# EAGLE design vidc_interposer2-PTH (EAGLE 9.4.2)
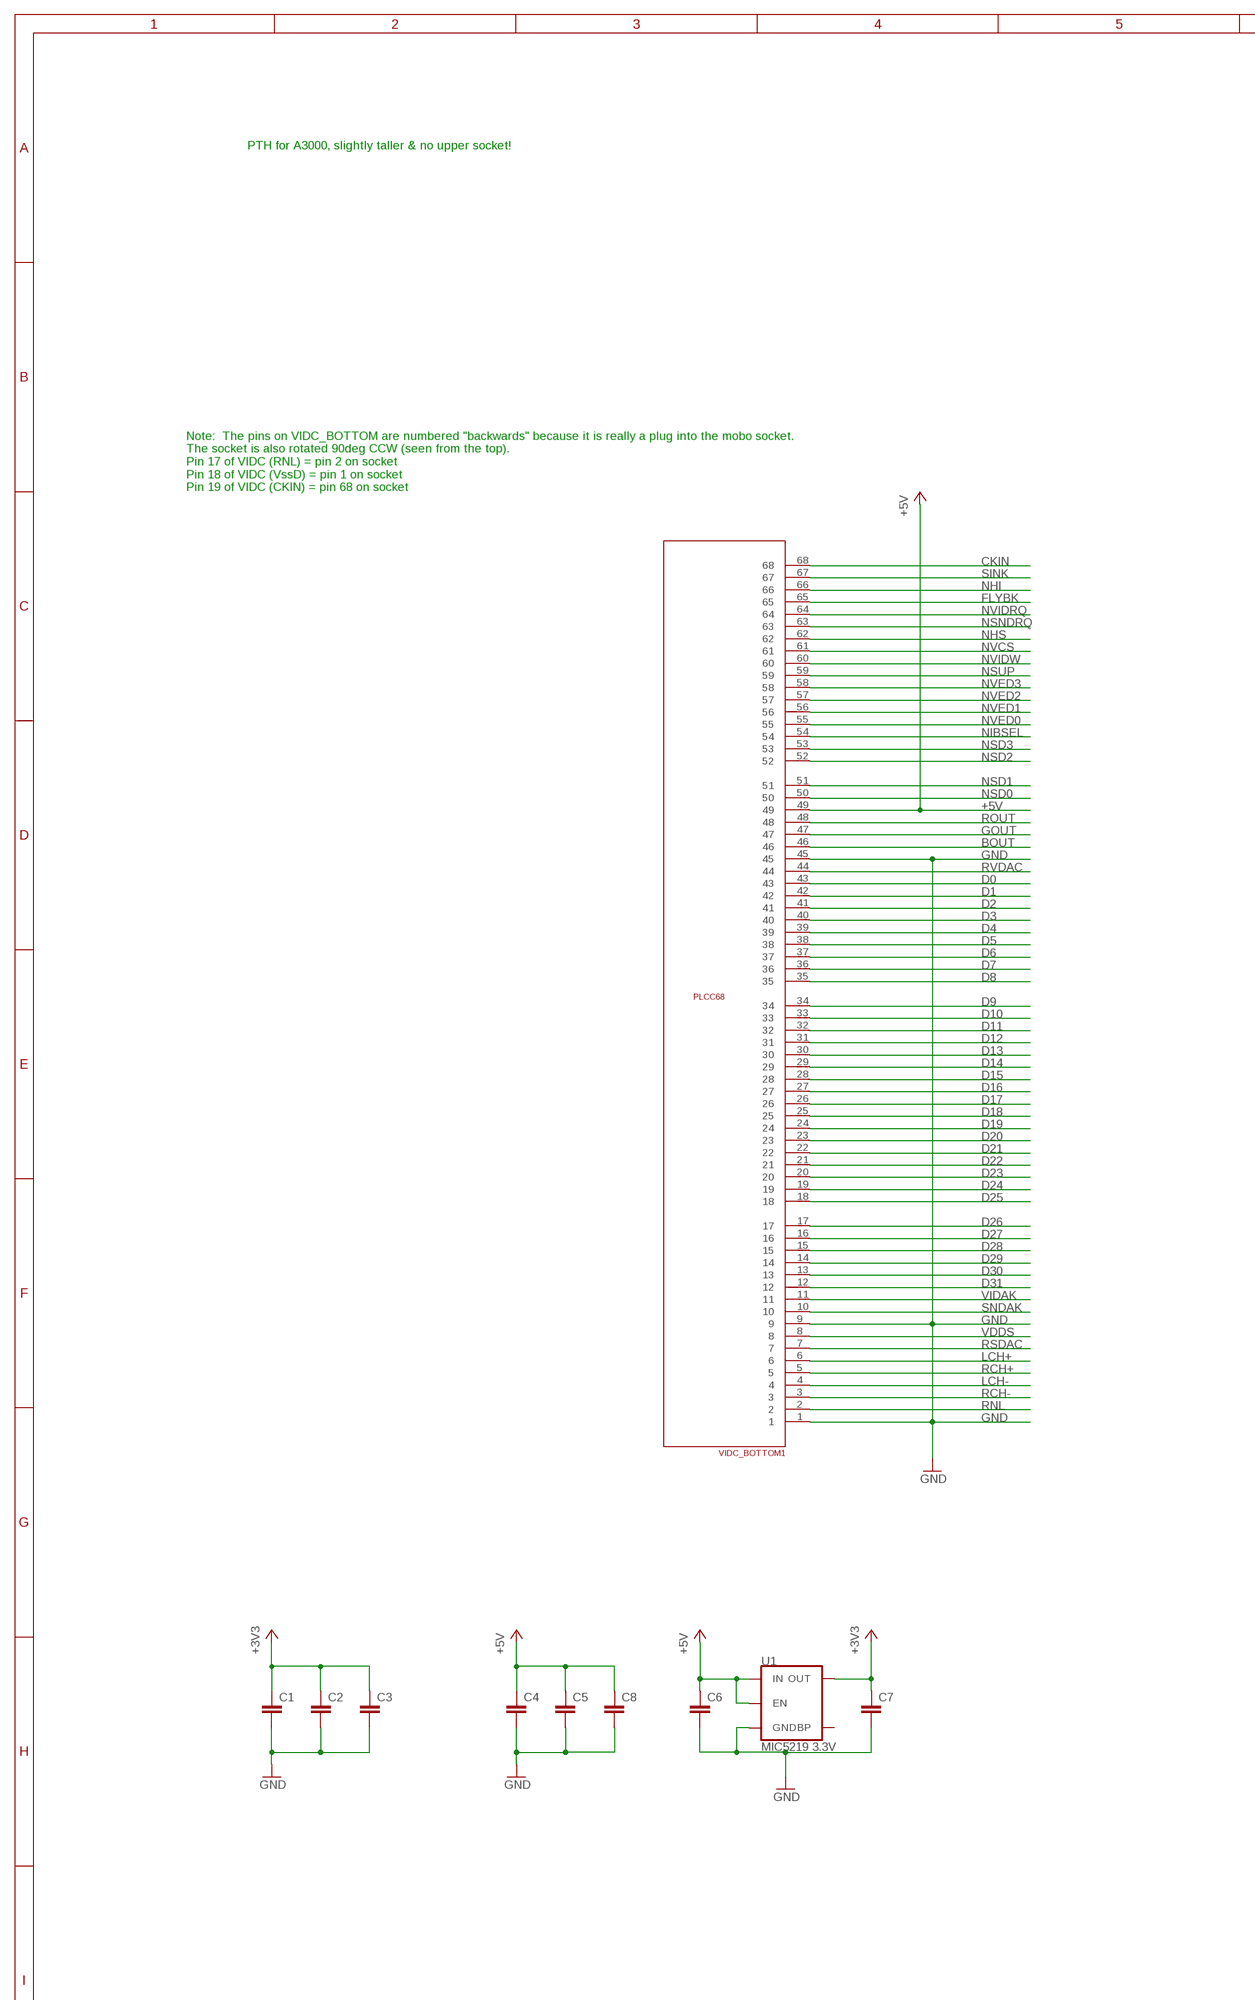
[diagram p0: schematic, sheet 1, part 1 of 2]
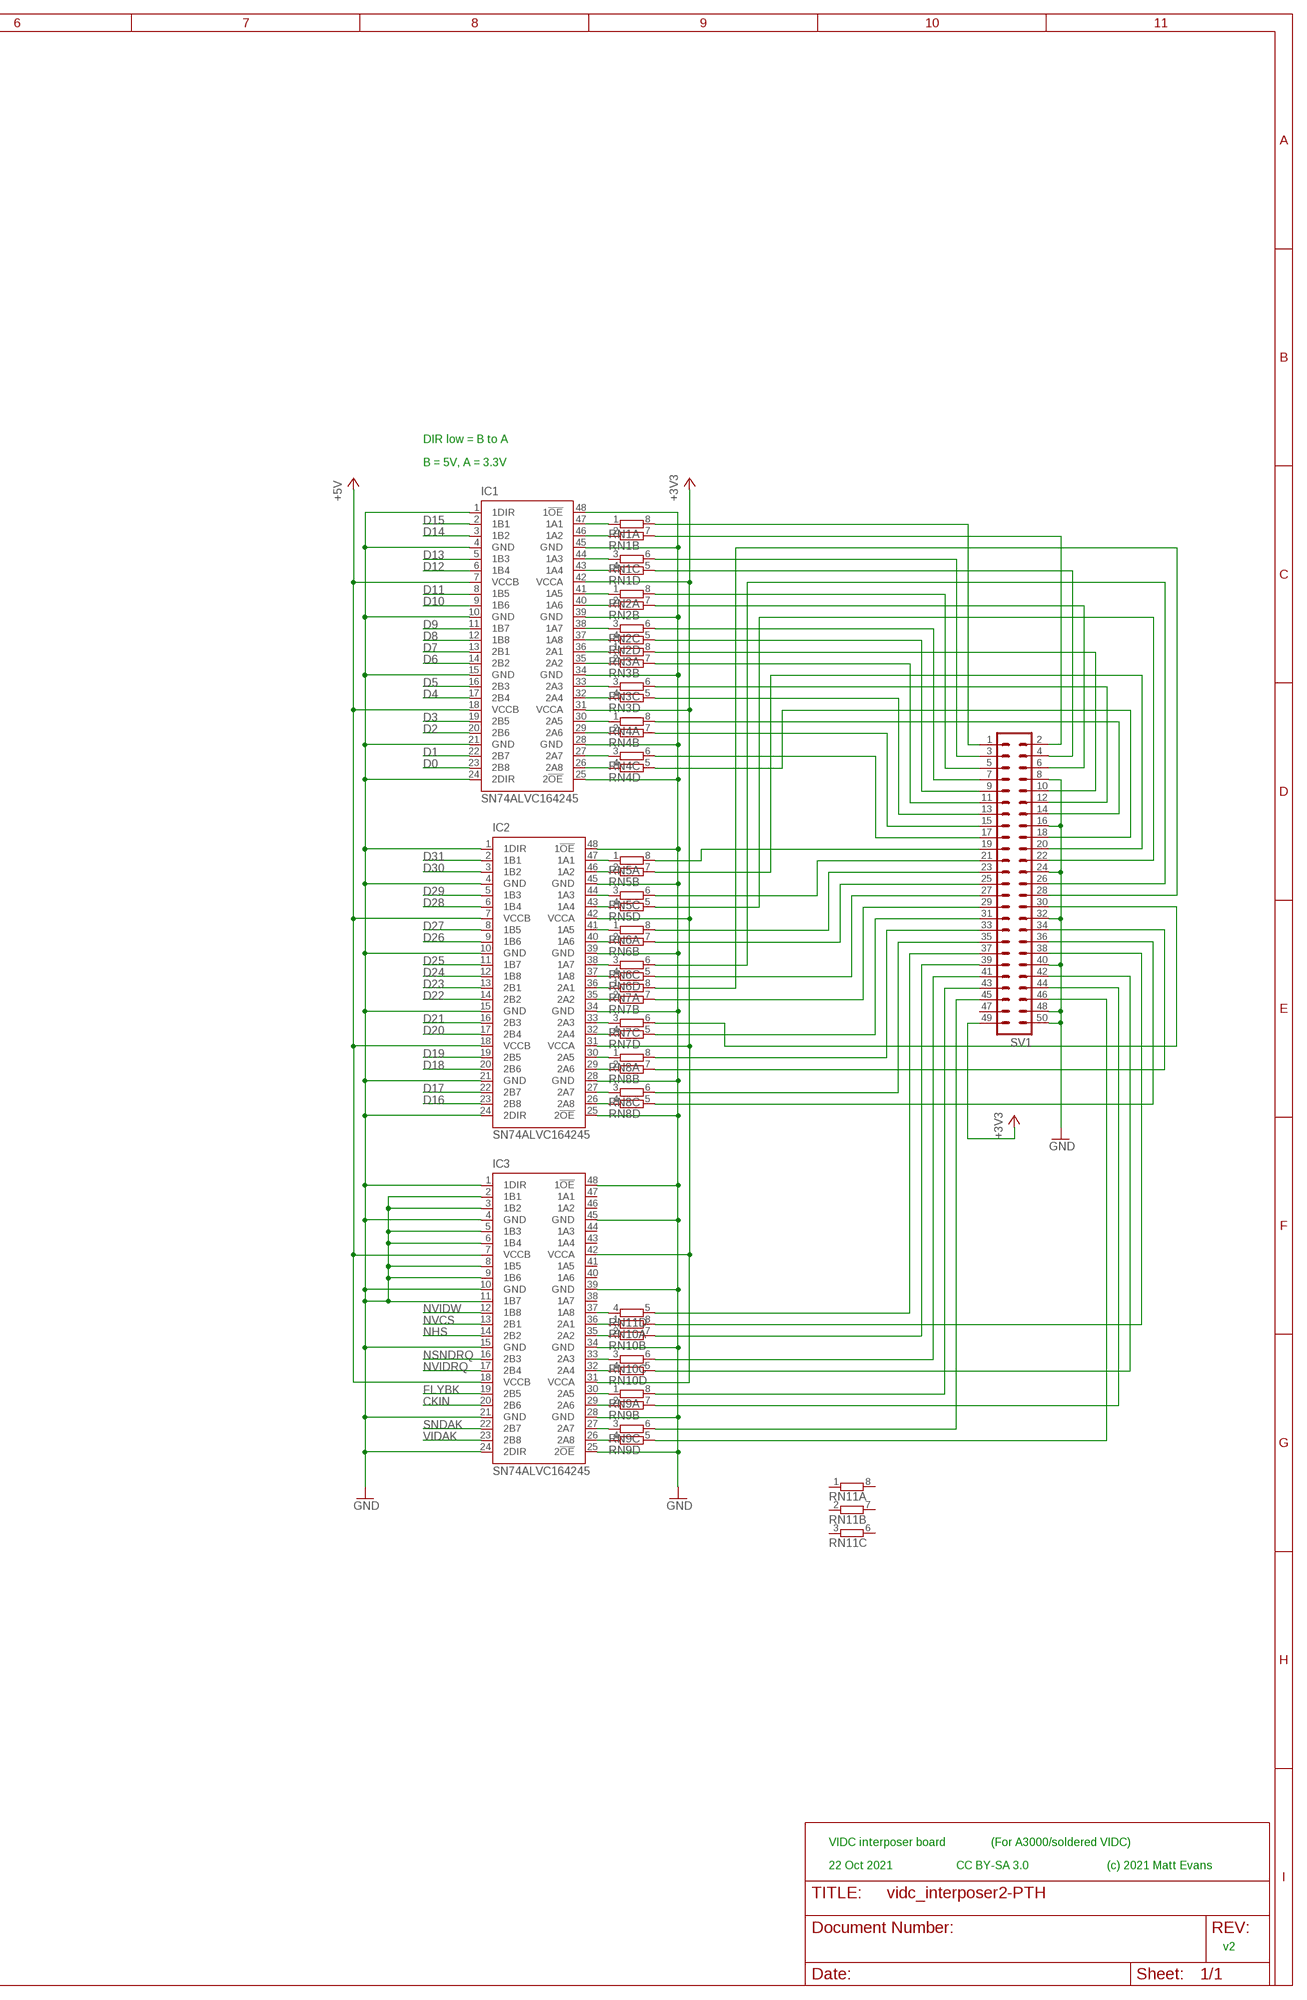
[diagram p1: schematic, sheet 1, part 2 of 2]

## Parts
C1  C-EUC0805  [C0805]
C2  C-EUC0805  [C0805]
C3  C-EUC0805  [C0805]
C4  C-EUC0805  [C0805]
C5  C-EUC0805  [C0805]
C6  C-EUC0805  [C0805]
C7  C-EUC0805  [C0805]
C8  C-EUC0805  [C0805]
IC1  SN74ALVC164245  [DL_R-PDSO-G48]
IC2  SN74ALVC164245  [DL_R-PDSO-G48]
IC3  SN74ALVC164245  [DL_R-PDSO-G48]
RN1  4R-NCAY16  [CAY16]
RN2  4R-NCAY16  [CAY16]
RN3  4R-NCAY16  [CAY16]
RN4  4R-NCAY16  [CAY16]
RN5  4R-NCAY16  [CAY16]
RN6  4R-NCAY16  [CAY16]
RN7  4R-NCAY16  [CAY16]
RN8  4R-NCAY16  [CAY16]
RN9  4R-NCAY16  [CAY16]
RN10  4R-NCAY16  [CAY16]
RN11  4R-NCAY16  [CAY16]
SV1  ML50  [ML50]
U1  MIC5219 3.3V  V_REG_MIC52193.3V  [SOT23-5]
VIDC_BOTTOM1  RAW_PLCC68PTH  [S68]

## Nets
+3V3: C1.1 C2.1 C3.1 C7.1 IC1.31(VCCA) IC1.42(VCCA) IC2.31(VCCA) IC2.42(VCCA) IC3.31(VCCA) IC3.42(VCCA) SV1.49 U1.5(OUT)
+5V: C4.1 C5.1 C6.1 C8.1 IC1.7(VCCB) IC1.18(VCCB) IC2.7(VCCB) IC2.18(VCCB) IC3.7(VCCB) IC3.18(VCCB) U1.1(IN) U1.3(EN) VIDC_BOTTOM1.49
BOUT: VIDC_BOTTOM1.46
CKIN: IC3.20(2B6) VIDC_BOTTOM1.68
D0: IC1.23(2B8) VIDC_BOTTOM1.43
D1: IC1.22(2B7) VIDC_BOTTOM1.42
D2: IC1.20(2B6) VIDC_BOTTOM1.41
D3: IC1.19(2B5) VIDC_BOTTOM1.40
D4: IC1.17(2B4) VIDC_BOTTOM1.39
D5: IC1.16(2B3) VIDC_BOTTOM1.38
D6: IC1.14(2B2) VIDC_BOTTOM1.37
D7: IC1.13(2B1) VIDC_BOTTOM1.36
D8: IC1.12(1B8) VIDC_BOTTOM1.35
D9: IC1.11(1B7) VIDC_BOTTOM1.34
D10: IC1.9(1B6) VIDC_BOTTOM1.33
D11: IC1.8(1B5) VIDC_BOTTOM1.32
D12: IC1.6(1B4) VIDC_BOTTOM1.31
D13: IC1.5(1B3) VIDC_BOTTOM1.30
D14: IC1.3(1B2) VIDC_BOTTOM1.29
D15: IC1.2(1B1) VIDC_BOTTOM1.28
D16: IC2.23(2B8) VIDC_BOTTOM1.27
D17: IC2.22(2B7) VIDC_BOTTOM1.26
D18: IC2.20(2B6) VIDC_BOTTOM1.25
D19: IC2.19(2B5) VIDC_BOTTOM1.24
D20: IC2.17(2B4) VIDC_BOTTOM1.23
D21: IC2.16(2B3) VIDC_BOTTOM1.22
D22: IC2.14(2B2) VIDC_BOTTOM1.21
D23: IC2.13(2B1) VIDC_BOTTOM1.20
D24: IC2.12(1B8) VIDC_BOTTOM1.19
D25: IC2.11(1B7) VIDC_BOTTOM1.18
D26: IC2.9(1B6) VIDC_BOTTOM1.17
D27: IC2.8(1B5) VIDC_BOTTOM1.16
D28: IC2.6(1B4) VIDC_BOTTOM1.15
D29: IC2.5(1B3) VIDC_BOTTOM1.14
D30: IC2.3(1B2) VIDC_BOTTOM1.13
D31: IC2.2(1B1) VIDC_BOTTOM1.12
FLYBK: IC3.19(2B5) VIDC_BOTTOM1.65
GND: C1.2 C2.2 C3.2 C4.2 C5.2 C6.2 C7.2 C8.2 IC1.1(1DIR) IC1.4(GND) IC1.10(GND) IC1.15(GND) IC1.21(GND) IC1.24(2DIR) IC1.25(2!OE) IC1.28(GND) IC1.34(GND) IC1.39(GND) IC1.45(GND) IC1.48(1!OE) IC2.1(1DIR) IC2.4(GND) IC2.10(GND) IC2.15(GND) IC2.21(GND) IC2.24(2DIR) IC2.25(2!OE) IC2.28(GND) IC2.34(GND) IC2.39(GND) IC2.45(GND) IC2.48(1!OE) IC3.1(1DIR) IC3.2(1B1) IC3.3(1B2) IC3.4(GND) IC3.5(1B3) IC3.6(1B4) IC3.8(1B5) IC3.9(1B6) IC3.10(GND) IC3.11(1B7) IC3.15(GND) IC3.21(GND) IC3.24(2DIR) IC3.25(2!OE) IC3.28(GND) IC3.34(GND) IC3.39(GND) IC3.45(GND) IC3.48(1!OE) SV1.8 SV1.16 SV1.24 SV1.32 SV1.40 SV1.48 SV1.50 U1.2(GND) VIDC_BOTTOM1.1 VIDC_BOTTOM1.9 VIDC_BOTTOM1.45
GOUT: VIDC_BOTTOM1.47
LCH+: VIDC_BOTTOM1.6
LCH-: VIDC_BOTTOM1.4
N$1: IC3.26(2A8) RN9.4
N$2: IC3.27(2A7) RN9.3
N$3: IC3.29(2A6) RN9.2
N$4: IC3.30(2A5) RN9.1
N$5: IC3.32(2A4) RN10.4
N$6: IC3.33(2A3) RN10.3
N$7: IC3.35(2A2) RN10.2
N$8: IC3.36(2A1) RN10.1
N$9: IC1.47(1A1) RN1.1
N$10: IC1.46(1A2) RN1.2
N$11: IC1.44(1A3) RN1.3
N$12: IC1.43(1A4) RN1.4
N$13: IC1.41(1A5) RN2.1
N$14: IC1.40(1A6) RN2.2
N$15: IC1.38(1A7) RN2.3
N$16: IC1.37(1A8) RN2.4
N$17: IC1.36(2A1) RN3.1
N$18: IC1.35(2A2) RN3.2
N$19: IC1.33(2A3) RN3.3
N$20: IC1.32(2A4) RN3.4
N$21: IC1.30(2A5) RN4.1
N$22: IC1.29(2A6) RN4.2
N$23: IC3.37(1A8) RN11.4
N$24: IC1.27(2A7) RN4.3
N$25: IC1.26(2A8) RN4.4
N$26: IC2.47(1A1) RN5.1
N$27: IC2.46(1A2) RN5.2
N$28: IC2.44(1A3) RN5.3
N$29: IC2.43(1A4) RN5.4
N$30: IC2.41(1A5) RN6.1
N$31: IC2.40(1A6) RN6.2
N$32: IC2.38(1A7) RN6.3
N$33: IC2.37(1A8) RN6.4
N$34: IC2.36(2A1) RN7.1
N$35: IC2.35(2A2) RN7.2
N$36: IC2.33(2A3) RN7.3
N$37: IC2.32(2A4) RN7.4
N$38: IC2.30(2A5) RN8.1
N$39: IC2.29(2A6) RN8.2
N$40: IC2.27(2A7) RN8.3
N$41: IC2.26(2A8) RN8.4
N$42: RN1.8 SV1.1
N$43: RN1.7 SV1.2
N$44: RN1.6 SV1.3
N$45: RN1.5 SV1.4
N$46: RN5.8 SV1.19
N$47: RN2.8 SV1.5
N$48: RN2.7 SV1.6
N$49: RN2.6 SV1.7
N$50: RN2.5 SV1.9
N$51: RN3.7 SV1.11
N$52: RN5.7 SV1.20
N$53: RN3.8 SV1.10
N$54: RN3.5 SV1.13
N$55: RN3.6 SV1.12
N$56: RN4.7 SV1.15
N$57: RN4.8 SV1.14
N$58: RN4.6 SV1.17
N$59: RN5.5 SV1.22
N$60: RN5.6 SV1.21
N$61: RN4.5 SV1.18
N$62: RN8.5 SV1.36
N$63: RN10.8 SV1.38
N$64: RN6.6 SV1.26
N$65: RN6.8 SV1.23
N$66: RN7.8 SV1.28
N$67: RN6.7 SV1.25
N$68: RN11.5 SV1.37
N$69: RN10.5 SV1.42
N$70: RN6.5 SV1.27
N$71: RN10.7 SV1.39
N$72: RN9.7 SV1.44
N$73: RN9.8 SV1.43
N$86: RN7.7 SV1.29
N$87: RN9.6 SV1.45
N$88: RN7.6 SV1.30
N$89: RN8.7 SV1.34
N$91: RN10.6 SV1.41
N$93: RN7.5 SV1.31
N$94: RN8.8 SV1.33
N$95: RN8.6 SV1.35
N$96: RN9.5 SV1.46
NHI: VIDC_BOTTOM1.66
NHS: IC3.14(2B2) VIDC_BOTTOM1.62
NIBSEL: VIDC_BOTTOM1.54
NSD0: VIDC_BOTTOM1.50
NSD1: VIDC_BOTTOM1.51
NSD2: VIDC_BOTTOM1.52
NSD3: VIDC_BOTTOM1.53
NSNDRQ: IC3.16(2B3) VIDC_BOTTOM1.63
NSUP: VIDC_BOTTOM1.59
NVCS: IC3.13(2B1) VIDC_BOTTOM1.61
NVED0: VIDC_BOTTOM1.55
NVED1: VIDC_BOTTOM1.56
NVED2: VIDC_BOTTOM1.57
NVED3: VIDC_BOTTOM1.58
NVIDRQ: IC3.17(2B4) VIDC_BOTTOM1.64
NVIDW: IC3.12(1B8) VIDC_BOTTOM1.60
RCH+: VIDC_BOTTOM1.5
RCH-: VIDC_BOTTOM1.3
RNL: VIDC_BOTTOM1.2
ROUT: VIDC_BOTTOM1.48
RSDAC: VIDC_BOTTOM1.7
RVDAC: VIDC_BOTTOM1.44
SINK: VIDC_BOTTOM1.67
SNDAK: IC3.22(2B7) VIDC_BOTTOM1.10
VDDS: VIDC_BOTTOM1.8
VIDAK: IC3.23(2B8) VIDC_BOTTOM1.11
Unconnected: IC3.38(1A7) IC3.40(1A6) IC3.41(1A5) IC3.43(1A4) IC3.44(1A3) IC3.46(1A2) IC3.47(1A1) RN11.1 RN11.2 RN11.3 RN11.6 RN11.7 RN11.8 SV1.47 U1.4(BP)

## Notes on the sheet
- PTH for A3000, slightly taller & no upper socket!
- DIR low = B to A
- B = 5V, A = 3.3V
- Note:  The pins on VIDC_BOTTOM are numbered "backwards" because it is really a plug into the mobo socket.
  The socket is also rotated 90deg CCW (seen from the top).
  Pin 17 of VIDC (RNL) = pin 2 on socket
  Pin 18 of VIDC (VssD) = pin 1 on socket
  Pin 19 of VIDC (CKIN) = pin 68 on socket
- VIDC interposer board | (For A3000/soldered VIDC)
- 22 Oct 2021 | CC BY-SA 3.0 | (c) 2021 Matt Evans
- v2

## Library data of the parts
C1-C8 = rcl:C-EU: CAPACITOR, European symbol; SPICEPREFIX: C
IC1-IC3 = matt:SN74ALVC164245: 16-BIT BUS TRANSCEIVER WITH 3-STATE OUTPUTS Auto generated by make-symbol-device-package-bsdl.ulp Rev. 33 Source: http://focus.ti.com/lit/ds/symlink/sn74lvcr162245.pdf; MPN: SN74LVCR162245DL; OC_FARNELL: 1739707; OC_NEWARK: 50R6613
RN1-RN11 = resistor-dil:4R-N: Array Chip Resistor Source: RS Component / Phycomp; OC_FARNELL: unknown; OC_NEWARK: unknown
SV1 = con-harting-ml:ML50: HARTING; OC_FARNELL: unknown; OC_NEWARK: unknown
U1 = SparkFun-IC-Power:V_REG_MIC5219: V_REG MIC5219 Standard 3.3V and 5V 500mA LDO voltage regulator in SOT-23 layout. Micrel part MIC5219. BP (by-pass) pin is used to lower output noise with 470pF cap, may be left open.; PROD_ID: VREG-09872
VIDC_BOTTOM1 = matt:RAW_PLCC68: PLCC68 raw footprint

## Board
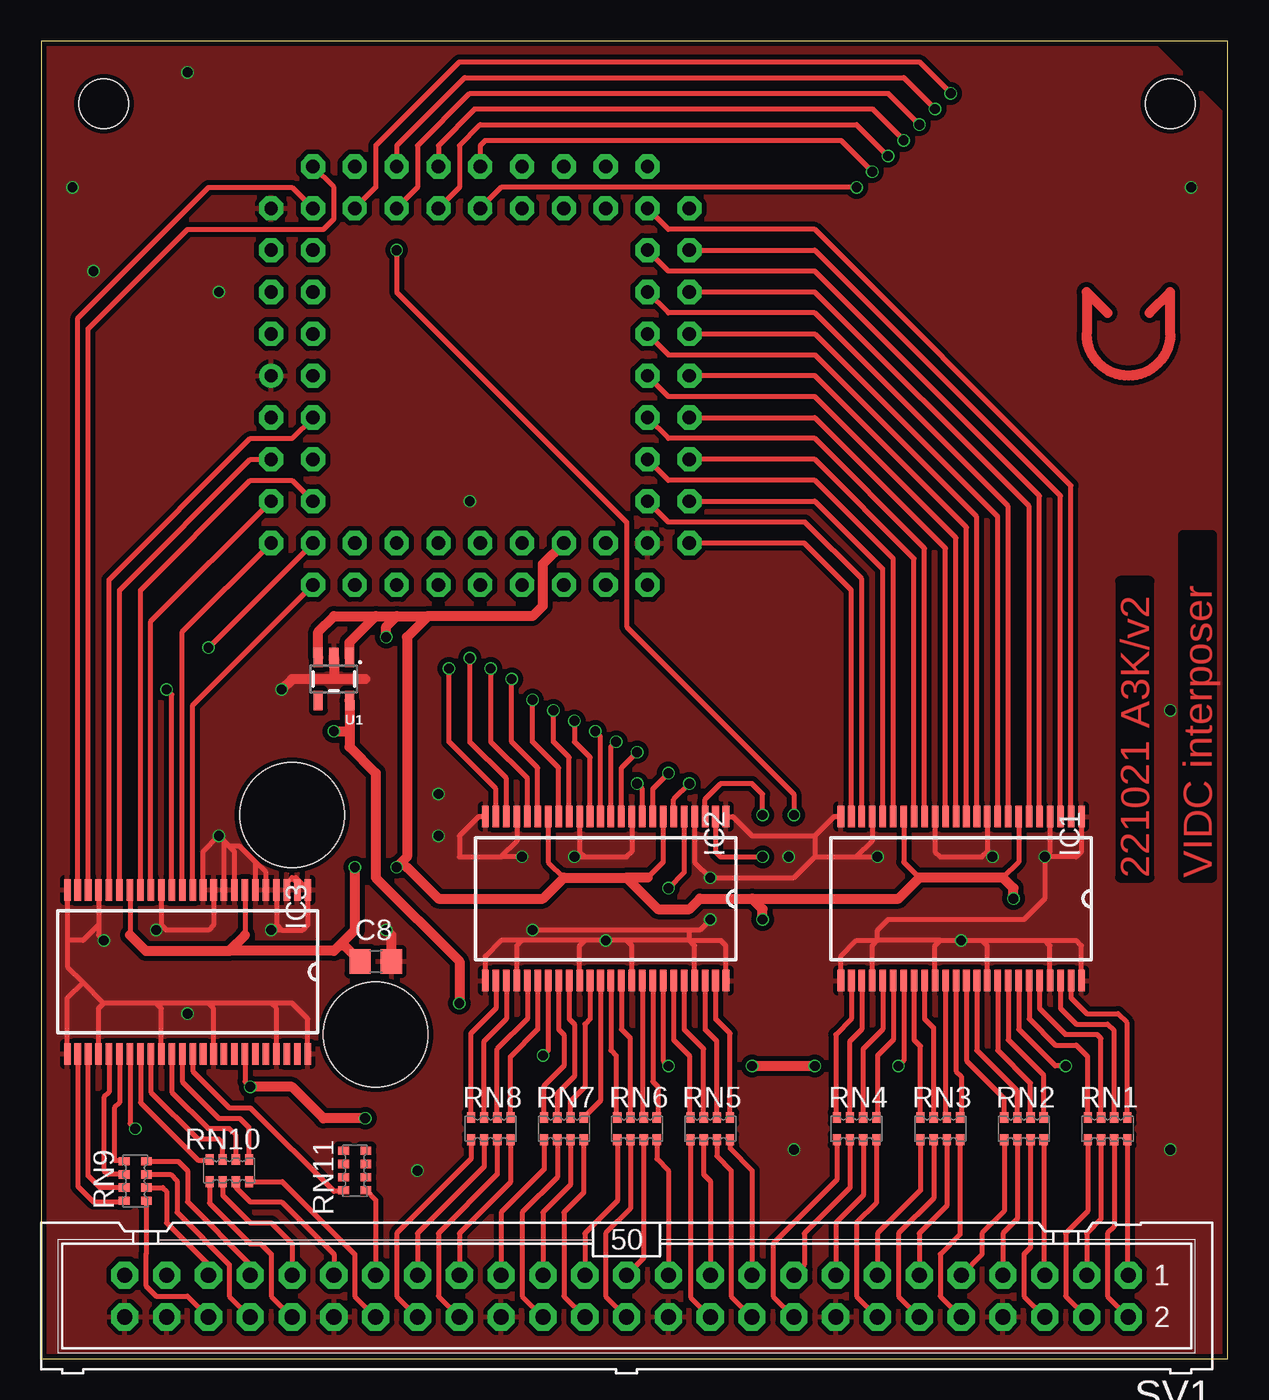
[diagram p2: board, top side]
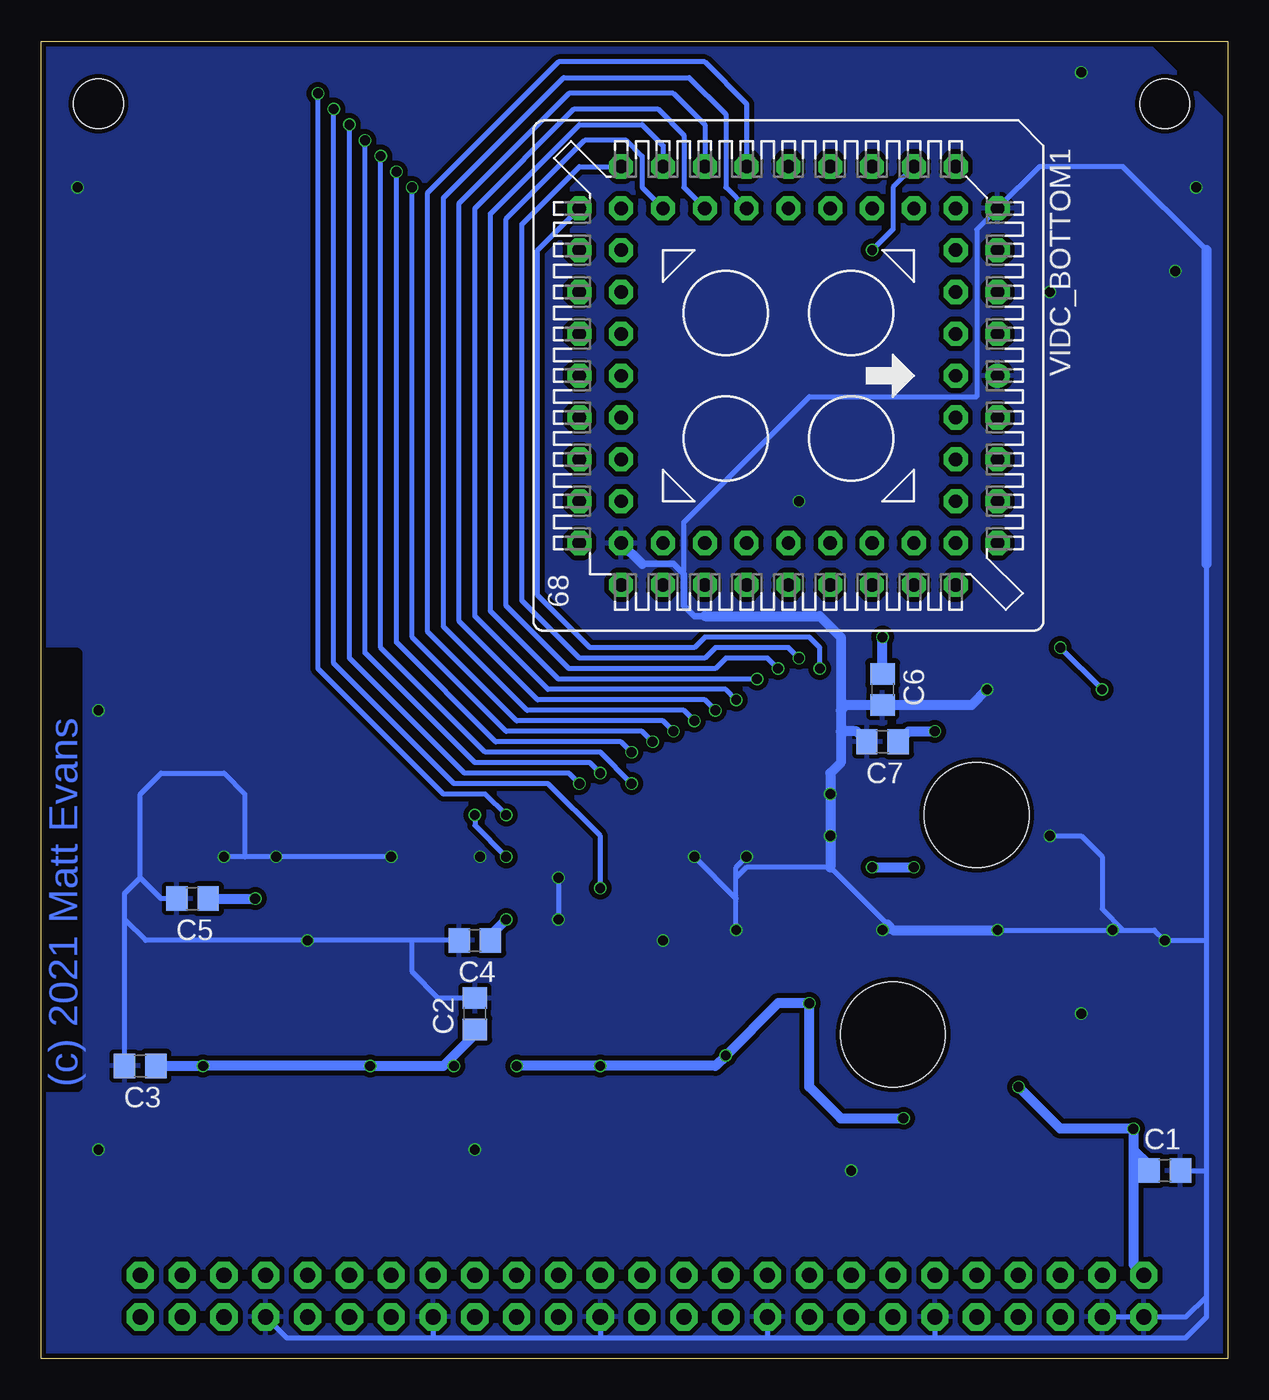
[diagram p3: board, bottom side, seen from below]

Size 72.06 x 80 mm. Coordinates in mm from the lower left corner, seen from the top.
Outline: 0,0 72.06,0 72.06,80 0,80 0,0
Copper layers (1*16): Top 0.035mm / dielectric 1.6mm / Bottom 0.035mm
Design rules "jlcpcb-2layers": minimum track width 5mil, minimum drill 0.3mm, track to track 5mil, track to pad 5mil, pad to pad 5mil, via to via 5mil, smd to smd 5mil, copper to edge 0.2mm, drill to drill 6mil, minimum pad ring 10mil, minimum via ring 3mil, stop-mask expansion 4mil, vias tented up to drill 0mil, thermal gap 10mil
Holes 6.35 mm at 15.24,33.02 20.32,19.68
Holes 3 mm at 3.81,76.2 68.58,76.2

### Footprints (pad centres in the part's own frame; a part is rotated, then mirrored left to right if it is on the bottom)
C0805 = smd 1.3 x 1.5: 1 -0.95,0; 2 0.95,0
DL_R-PDSO-G48 = smd 1.3 x 0.4: 1 -4.98,7.303; 2 -4.98,6.668; 3 -4.98,6.032; 4 -4.98,5.397; 5 -4.98,4.763; 6 -4.98,4.128; 7 -4.98,3.493; 8 -4.98,2.857; 9 -4.98,2.223; 10 -4.98,1.587; 11 -4.98,0.953; 12 -4.98,0.318; 13 -4.98,-0.318; 14 -4.98,-0.953; 15 -4.98,-1.587; 16 -4.98,-2.223; 17 -4.98,-2.857; 18 -4.98,-3.493; 19 -4.98,-4.128; 20 -4.98,-4.763; 21 -4.98,-5.397; 22 -4.98,-6.032; 23 -4.98,-6.668; 24 -4.98,-7.303; 25 4.98,-7.303; 26 4.98,-6.668; 27 4.98,-6.032; 28 4.98,-5.397; 29 4.98,-4.763; 30 4.98,-4.128; 31 4.98,-3.493; 32 4.98,-2.857; 33 4.98,-2.223; 34 4.98,-1.587; 35 4.98,-0.953; 36 4.98,-0.318; 37 4.98,0.318; 38 4.98,0.953; 39 4.98,1.587; 40 4.98,2.223; 41 4.98,2.857; 42 4.98,3.493; 43 4.98,4.128; 44 4.98,4.763; 45 4.98,5.397; 46 4.98,6.032; 47 4.98,6.668; 48 4.98,7.303
CAY16 = smd 0.5 x 0.65: 1 -1.2,-0.675; 2 -0.4,-0.675; 3 0.4,-0.675; 4 1.2,-0.675; 5 1.2,0.675; 6 0.4,0.675; 7 -0.4,0.675; 8 -1.2,0.675
ML50 = drill 0.914 octagon: 1 -30.48,-1.27; 2 -30.48,1.27; 3 -27.94,-1.27; 4 -27.94,1.27; 5 -25.4,-1.27; 6 -25.4,1.27; 7 -22.86,-1.27; 8 -22.86,1.27; 9 -20.32,-1.27; 10 -20.32,1.27; 11 -17.78,-1.27; 12 -17.78,1.27; 13 -15.24,-1.27; 14 -15.24,1.27; 15 -12.7,-1.27; 16 -12.7,1.27; 17 -10.16,-1.27; 18 -10.16,1.27; 19 -7.62,-1.27; 20 -7.62,1.27; 21 -5.08,-1.27; 22 -5.08,1.27; 23 -2.54,-1.27; 24 -2.54,1.27; 25 0,-1.27; 26 0,1.27; 27 2.54,-1.27; 28 2.54,1.27; 29 5.08,-1.27; 30 5.08,1.27; 31 7.62,-1.27; 32 7.62,1.27; 33 10.16,-1.27; 34 10.16,1.27; 35 12.7,-1.27; 36 12.7,1.27; 37 15.24,-1.27; 38 15.24,1.27; 39 17.78,-1.27; 40 17.78,1.27; 41 20.32,-1.27; 42 20.32,1.27; 43 22.86,-1.27; 44 22.86,1.27; 45 25.4,-1.27; 46 25.4,1.27; 47 27.94,-1.27; 48 27.94,1.27; 49 30.48,-1.27; 50 30.48,1.27
SOT23-5 = smd 0.55 x 1.2: 1 -0.95,-1.3; 2 0,-1.3; 3 0.95,-1.3; 4 0.95,1.3; 5 -0.95,1.3
S68 = drill 0.813: 1 0,12.7 | drill 0.813 octagon: 2 0,10.16; 3 -2.54,12.7; 4 -2.54,10.16; 5 -5.08,12.7; 6 -5.08,10.16; 7 -7.62,12.7; 8 -7.62,10.16; 9 -10.16,12.7; 10 -12.7,10.16; 11 -10.16,10.16; 12 -12.7,7.62; 13 -10.16,7.62; 14 -12.7,5.08; 15 -10.16,5.08; 16 -12.7,2.54; 17 -10.16,2.54; 18 -12.7,0; 19 -10.16,0; 20 -12.7,-2.54; 21 -10.16,-2.54; 22 -12.7,-5.08; 23 -10.16,-5.08; 24 -12.7,-7.62; 25 -10.16,-7.62; 26 -12.7,-10.16; 27 -10.16,-12.7; 28 -10.16,-10.16; 29 -7.62,-12.7; 30 -7.62,-10.16; 31 -5.08,-12.7; 32 -5.08,-10.16; 33 -2.54,-12.7; 34 -2.54,-10.16; 35 0,-12.7; 36 0,-10.16; 37 2.54,-12.7; 38 2.54,-10.16; 39 5.08,-12.7; 40 5.08,-10.16; 41 7.62,-12.7; 42 7.62,-10.16; 43 10.16,-12.7; 44 12.7,-10.16; 45 10.16,-10.16; 46 12.7,-7.62; 47 10.16,-7.62; 48 12.7,-5.08; 49 10.16,-5.08; 50 12.7,-2.54; 51 10.16,-2.54; 52 12.7,0; 53 10.16,0; 54 12.7,2.54; 55 10.16,2.54; 56 12.7,5.08; 57 10.16,5.08; 58 12.7,7.62; 59 10.16,7.62; 60 12.7,10.16; 61 10.16,12.7; 62 10.16,10.16; 63 7.62,12.7; 64 7.62,10.16; 65 5.08,12.7; 66 5.08,10.16; 67 2.54,12.7; 68 2.54,10.16

### Placement (x,y rotation side)
C1  3.81,11.43 0 bottom
C2  45.72,20.95 90 bottom
C3  66.04,17.78 180 bottom
C4  45.72,25.4 180 bottom
C5  62.87,27.94 180 bottom
C6  20.95,40.64 270 bottom
C7  20.95,37.47 180 bottom
C8  20.32,24.13 0 top
IC1  55.88,27.94 270 top
IC2  34.29,27.94 270 top
IC3  8.89,23.5 270 top
RN1  64.77,13.97 180 top
RN2  59.69,13.97 180 top
RN3  54.61,13.97 180 top
RN4  49.53,13.97 180 top
RN5  40.64,13.97 180 top
RN6  36.2,13.97 180 top
RN7  31.75,13.97 180 top
RN8  27.3,13.97 180 top
RN9  5.71,10.79 270 top
RN10  11.43,11.43 180 top
RN11  19.05,11.43 270 top
SV1  35.56,3.81 180 top
U1  17.78,41.27 180 top
VIDC_BOTTOM1  26.67,59.69 270 bottom

### Tracks (layer width: path | path; a pad name or v marks a point on that pad's centre or on a via)
+3V3  (via drill 0.6)
  Top 0.305: IC1.42 59.37,20 61.59,17.78 v62.23,17.78 | IC1.31 52.39,18.1 v52.07,17.78 | IC2.42 37.78,18.1 v38.1,17.78 | IC2.31 30.8,18.73 v30.48,18.41 | IC3.42 12.38,16.83 v12.7,16.51 | IC3.31 5.4,14.29 v5.71,13.97
  Top 0.61: v43.18,17.78 v46.99,17.78 | v25.4,21.59 25.4,24.13 20.32,29.21 20.32,35.56 18.73,37.15 18.73,38.1 | v19.68,14.61 17.14,14.61 15.24,16.51 v12.7,16.51 | U1.5 18.73,38.1 | v17.78,38.1 18.73,38.1
  Bottom 0.305: 45.4,20 C2.1 | v46.99,17.78 47.62,17.78 | C1.1 4.76,11.74
  Bottom 0.61: C3.1 v62.23,17.78 v52.07,17.78 47.62,17.78 45.4,20 | v43.18,17.78 v38.1,17.78 31.11,17.78 v30.48,18.41 27.3,21.59 v25.4,21.59 25.4,16.51 23.5,14.61 v19.68,14.61 | v12.7,16.51 10.16,13.97 v5.71,13.97 5.71,12.7 | 5.71,12.7 5.71,5.71 SV1.49 | 4.76,11.74 5.71,12.7 | C7.1 19.37,38.1 v17.78,38.1
+5V  (via drill 0.6)
  Top 0.305: IC1.7 59.37,30.16 58.42,29.21 | 53.34,29.21 52.39,30.16 IC1.18 | IC2.7 37.78,30.16 36.83,29.21 | IC2.18 30.8,30.16 31.75,29.21 | IC3.18 5.4,25.72 | IC3.7 12.38,25.72 | 22.23,29.84 v21.59,29.84
  Top 0.61: 23.5,45.09 29.84,45.09 30.48,45.72 30.48,48.26 VIDC_BOTTOM1.49 | 23.5,45.09 22.23,43.81 22.23,30.48 v21.59,29.84 | 22.23,29.84 24.13,27.94 30.48,27.94 31.75,29.21 35.56,29.21 | 43.18,27.94 40.01,27.94 39.37,27.3 37.47,27.3 35.56,29.21 | 43.18,27.94 52.07,27.94 53.34,29.21 58.42,29.21 59.05,28.57 v59.05,27.94 | v43.81,26.67 43.81,27.3 43.18,27.94 | 20.32,45.09 17.78,45.09 16.83,44.13 U1.3 | 20.32,45.09 21.59,45.09 | 21.59,45.09 23.5,45.09 | 5.4,25.72 6.35,24.77 11.43,24.77 | 12.38,25.72 11.43,24.77 | v19.05,29.84 19.05,26.04 18.1,25.08 | 18.1,25.08 17.78,24.77 11.43,24.77 | 36.83,29.21 35.56,29.21 | C8.1 18.42,25.08 18.1,25.08 | U1.1 18.73,43.49 20.32,45.09 | v20.95,43.81 20.95,44.45 21.59,45.09
  Bottom 0.305: C4.1 44.77,25.71
  Bottom 0.61: C5.1 v59.05,27.94 | 44.77,25.71 v43.81,26.67 | v21.59,29.84 v19.05,29.84 | C6.1 v20.95,43.81
CKIN
  Top 0.305: IC3.20 4.13,47.31 12.7,55.88 15.24,55.88 VIDC_BOTTOM1.68
D0
  Top 0.305: IC1.23 49.21,46.67 46.35,49.53 VIDC_BOTTOM1.43
D1
  Top 0.305: IC1.22 49.85,47.35 46.4,50.8 38.1,50.8 VIDC_BOTTOM1.42
D2
  Top 0.305: IC1.20 51.12,47.94 46.99,52.07 VIDC_BOTTOM1.41
D3
  Top 0.305: IC1.19 51.75,48.58 46.99,53.34 38.1,53.34 VIDC_BOTTOM1.40
D4
  Top 0.305: IC1.17 53.02,48.58 46.99,54.61 VIDC_BOTTOM1.39
D5
  Top 0.305: IC1.16 53.66,49.21 46.99,55.88 38.1,55.88 VIDC_BOTTOM1.38
D6
  Top 0.305: IC1.14 54.93,49.21 46.99,57.15 VIDC_BOTTOM1.37
D7
  Top 0.305: IC1.13 55.56,49.85 46.99,58.42 38.1,58.42 VIDC_BOTTOM1.36
D8
  Top 0.305: IC1.12 56.2,50.48 46.99,59.69 VIDC_BOTTOM1.35
D9
  Top 0.305: IC1.11 56.83,51.12 46.99,60.96 38.1,60.96 VIDC_BOTTOM1.34
D10
  Top 0.305: IC1.9 58.1,51.12 46.99,62.23 VIDC_BOTTOM1.33
D11
  Top 0.305: IC1.8 58.74,51.75 46.99,63.5 38.1,63.5 VIDC_BOTTOM1.32
D12
  Top 0.305: IC1.6 60.01,51.75 46.99,64.77 VIDC_BOTTOM1.31
D13
  Top 0.305: IC1.5 60.64,52.39 46.99,66.04 38.1,66.04 VIDC_BOTTOM1.30
D14
  Top 0.305: IC1.3 61.91,52.39 46.99,67.31 VIDC_BOTTOM1.29
D15
  Top 0.305: IC1.2 62.55,53.02 46.99,68.58 38.1,68.58 VIDC_BOTTOM1.28
D16  (via drill 0.6)
  Top 0.305: IC2.23 27.62,34.61 24.77,37.47 v24.77,41.91
  Bottom 0.305: v24.77,41.91 24.77,43.18 25.4,43.81 31.75,43.81 32.38,43.18 38.73,43.18 41.91,46.35 41.91,67.31 VIDC_BOTTOM1.27
D17  (via drill 0.6)
  Top 0.305: v26.04,42.55 26.04,37.47 28.26,35.24 IC2.22
  Bottom 0.305: v26.04,42.55 26.67,43.18 31.11,43.18 31.75,42.55 39.37,42.55 42.86,46.04 42.86,68.9 39.37,72.39 VIDC_BOTTOM1.26
D18  (via drill 0.6)
  Top 0.305: v27.3,41.91 27.3,37.47 29.53,35.24 IC2.20
  Bottom 0.305: v27.3,41.91 27.94,42.55 30.48,42.55 31.11,41.91 40.01,41.91 43.81,45.72 43.81,69.22 39.05,73.98 36.51,73.98 35.56,73.03 35.56,71.12 VIDC_BOTTOM1.25
D19  (via drill 0.6)
  Top 0.305: IC2.19 30.16,35.88 28.57,37.47 v28.57,41.27
  Bottom 0.305: v28.57,41.27 40.64,41.27 44.77,45.4 44.77,69.53 39.37,74.93 35.56,74.93 34.29,73.66 VIDC_BOTTOM1.24
D20  (via drill 0.6)
  Top 0.305: IC2.17 31.43,35.88 29.84,37.47 v29.84,40.01
  Bottom 0.305: v29.84,40.01 30.48,40.64 41.27,40.64 45.72,45.09 45.72,69.85 39.69,75.88 34.61,75.88 33.02,74.3 33.02,71.12 VIDC_BOTTOM1.23
D21  (via drill 0.6)
  Top 0.305: IC2.16 32.07,36.51 31.11,37.47 v31.11,39.37
  Bottom 0.305: v31.11,39.37 31.75,40.01 41.91,40.01 46.67,44.77 46.67,70.17 40.01,76.83 33.66,76.83 31.75,74.93 VIDC_BOTTOM1.22
D22  (via drill 0.6)
  Top 0.305: IC2.14 33.34,36.51 32.38,37.47 v32.38,38.73
  Bottom 0.305: v32.38,38.73 33.02,39.37 42.55,39.37 47.62,44.45 47.62,70.48 40.32,77.79 32.7,77.79 30.48,75.56 30.48,71.12 VIDC_BOTTOM1.21
D23  (via drill 0.6)
  Top 0.305: IC2.13 33.97,37.78 v33.66,38.1
  Bottom 0.305: v33.66,38.1 34.29,38.73 43.18,38.73 48.58,44.13 48.58,70.8 40.64,78.74 31.75,78.74 29.21,76.2 VIDC_BOTTOM1.20
D24  (via drill 0.6)
  Top 0.305: IC2.12 34.61,37.15 v34.92,37.47 | v49.53,71.12 27.94,71.12 VIDC_BOTTOM1.19
  Bottom 0.305: v34.92,37.47 35.56,38.1 43.81,38.1 49.53,43.81 v49.53,71.12
D25  (via drill 0.6)
  Top 0.305: v36.2,36.83 35.24,35.88 IC2.11 | v50.48,72.07 48.58,73.98 26.99,73.98 26.67,73.66 VIDC_BOTTOM1.18
  Bottom 0.305: v36.2,36.83 36.83,37.47 44.45,37.47 50.48,43.5 v50.48,72.07
D26  (via drill 0.6)
  Top 0.305: IC2.9 36.51,34.61 v36.2,34.92 | v51.44,73.03 49.53,74.93 26.67,74.93 25.4,73.66 25.4,71.12 VIDC_BOTTOM1.17
  Bottom 0.305: v36.2,34.92 38.1,36.83 45.09,36.83 51.44,43.18 v51.44,73.03
D27  (via drill 0.6)
  Top 0.305: IC2.8 37.15,34.61 v38.1,35.56 | v52.39,73.98 50.48,75.88 26.35,75.88 24.13,73.66 VIDC_BOTTOM1.16
  Bottom 0.305: v38.1,35.56 38.73,36.2 45.72,36.2 52.39,42.86 v52.39,73.98
D28  (via drill 0.6)
  Top 0.305: v39.37,34.92 38.42,33.97 IC2.6 | v53.34,74.93 51.44,76.83 26.04,76.83 22.86,73.66 22.86,71.12 VIDC_BOTTOM1.15
  Bottom 0.305: v39.37,34.92 40.01,35.56 46.35,35.56 53.34,42.55 v53.34,74.93
D29  (via drill 0.6)
  Top 0.305: IC2.5 39.05,29.53 v38.1,28.57 | v54.29,75.88 52.39,77.79 25.72,77.79 21.59,73.66 VIDC_BOTTOM1.14
  Bottom 0.305: v38.1,28.57 38.1,31.75 41.27,34.92 46.99,34.92 54.29,42.23 v54.29,75.88
D30  (via drill 0.6)
  Top 0.305: IC2.3 40.32,33.97 41.27,34.92 43.18,34.92 43.81,34.29 v43.81,33.02 | v55.24,76.83 53.34,78.74 25.4,78.74 20.32,73.66 20.32,71.12 VIDC_BOTTOM1.13
  Bottom 0.305: v43.81,33.02 45.09,34.29 47.62,34.29 55.24,41.91 v55.24,76.83
D31  (via drill 0.6)
  Top 0.305: IC2.2 40.96,30.8 41.27,30.48 v43.81,30.48 | v21.59,67.31 21.59,64.77 35.56,50.8 35.56,44.45 45.72,34.29 v45.72,33.02
  Bottom 0.305: v43.81,30.48 45.72,32.38 v45.72,33.02 | v21.59,67.31 20.32,68.58 20.32,71.12 VIDC_BOTTOM1.12
FLYBK
  Top 0.305: IC3.19 4.76,46.67 12.7,54.61 VIDC_BOTTOM1.65
GND  (via drill 0.6)
  Top 0.305: IC1.15 54.29,30.8 54.61,30.48 57.15,30.48 57.47,30.8 | IC1.10 57.47,30.8 | IC1.4 61.28,30.8 v60.96,30.48 | IC1.24 48.16,32.92 46.99,31.75 | IC1.21 50.48,31.43 49.53,30.48 | IC1.1 63.18,30.8 62.87,30.48 v60.96,30.48 | 46.99,31.75 46.99,30.48 | 46.99,30.48 49.53,30.48 | 57.47,30.8 v57.78,30.48 | v60.96,30.48 60.96,27.94 59.69,26.67 51.44,26.67 50.8,26.04 50.8,25.4 | 49.53,30.48 v50.8,30.48 | IC1.28 50.48,25.08 50.8,25.4 | IC1.25 48.58,24.45 49.53,25.4 50.8,25.4 | IC1.34 54.29,25.08 54.61,25.4 | 54.61,25.4 57.15,25.4 | 57.15,25.4 60.96,25.4 | 60.96,25.4 62.87,25.4 63.18,25.08 IC1.48 | IC1.45 61.28,25.08 60.96,25.4 | IC1.39 57.47,25.08 57.15,25.4 | 54.61,25.4 50.8,25.4 | IC2.1 42.01,32.92 43.18,31.75 46.99,31.75 | IC2.4 39.69,30.16 v40.64,29.21 45.72,29.21 46.99,30.48 | IC2.24 26.57,32.92 25.4,31.75 25.4,30.48 27.94,30.48 | IC2.21 28.89,31.43 27.94,30.48 | IC2.15 32.7,30.8 33.02,30.48 | 33.02,30.48 35.56,30.48 35.88,30.8 IC2.10 | 39.37,26.04 40.01,26.04 v40.64,26.67 | 39.37,26.04 v29.84,26.04 | v32.38,30.48 33.02,30.48 | v29.21,30.48 27.94,30.48 | IC2.45 39.69,25.08 39.37,25.4 | 39.37,25.4 41.27,25.4 41.59,25.08 IC2.48 | 39.37,25.4 35.56,25.4 | 35.56,25.4 33.02,25.4 | 33.02,25.4 29.21,25.4 | 29.21,25.4 27.94,25.4 26.99,24.45 IC2.25 | IC2.28 28.89,25.08 29.21,25.4 | IC2.34 32.7,25.08 33.02,25.4 | IC2.39 35.88,25.08 35.56,25.4 | 39.37,25.4 39.37,26.04 | IC3.24 1.59,25.4 | 1.59,25.4 1.59,23.81 2.54,22.86 | IC3.25 1.59,21.91 2.54,22.86 | IC3.48 16.19,20.64 15.24,21.59 13.97,21.59 | 13.97,21.59 10.16,21.59 | 10.16,21.59 6.99,21.59 | 6.99,21.59 3.81,21.59 | 3.81,21.59 2.54,22.86 | IC3.45 14.29,21.27 13.97,21.59 | IC3.39 10.48,21.27 10.16,21.59
  Top 0.305: IC3.34 7.3,21.27 6.99,21.59 | IC3.28 3.49,21.27 3.81,21.59 | 1.59,25.4 2.54,25.4 3.49,26.35 IC3.21 3.49,25.72 v3.81,25.4 | IC3.15 7.3,26.35 | 7.3,26.35 7.62,26.04 10.16,26.04 10.48,26.35 IC3.10 | 7.3,26.35 v6.99,26.04 | IC3.11 9.84,30.8 v10.79,31.75 | IC3.9 11.11,31.43 v10.79,31.75 | IC3.8 11.75,30.8 v10.79,31.75 | 14.61,26.04 15.88,26.04 16.19,26.35 IC3.1 15.46,29.21 15.24,29.21 | 14.29,26.35 14.61,26.04 | 14.61,26.04 v13.97,26.04 14.29,26.35 | IC3.3 14.92,28.89 15.24,29.21 | IC3.5 13.65,29.53 13.02,30.16 | 13.02,30.16 12.06,31.11 11.43,31.11 v10.79,31.75 | IC3.6 13.02,30.16 | IC3.2 15.56,28.89 15.24,29.21 | IC3.4 14.29,26.35
  Top 0.61: C8.2 21.27,25.72 v20.95,26.04 | 19.68,41.27 17.78,41.27 | 17.78,41.27 15.24,41.27 v14.61,40.64 | U1.2 17.78,41.27
  Bottom 0.305: 59.69,30.48 v57.78,30.48 v50.8,30.48 | 59.69,30.48 v60.96,30.48 | v29.84,26.04 29.84,27.94 | 29.84,27.94 v32.38,30.48 | 29.84,27.94 29.84,29.21 | 29.84,29.21 29.84,29.84 v29.21,30.48 | v40.64,29.21 v40.64,26.67 | 67.31,17.78 C3.2 66.99,26.67 | C5.2 64.77,27.94 66.04,29.21 | 66.04,29.21 66.04,34.29 64.77,35.56 60.96,35.56 59.69,34.29 59.69,30.48 | 66.99,26.67 66.99,28.26 66.04,29.21 | C4.2 49.53,25.4 | 49.53,25.4 65.72,25.4 66.99,26.67 | C2.2 47.94,21.91 49.53,23.5 49.53,25.4 | 29.84,29.21 29.21,29.84 24.13,29.84 20.64,26.36 | SV1.50 SV1.48 2.54,2.54 1.27,3.81 | 1.27,3.81 1.27,11.43 | 1.27,11.43 1.27,25.4 | 1.27,25.4 1.27,48.26 | C1.2 1.27,11.43 | 1.27,25.4 v3.81,25.4 4.45,26.04 6.35,26.04 | 6.35,26.04 v6.99,26.04 v13.97,26.04 | v10.79,31.75 8.89,31.75 7.62,30.48 7.62,27.3 6.35,26.04 | SV1.8 57.15,1.27 48.26,1.27 | 48.26,1.27 38.1,1.27 | 38.1,1.27 27.94,1.27 | 27.94,1.27 17.78,1.27 | 17.78,1.27 2.54,1.27 1.27,2.54 1.27,3.81 | SV1.40 17.78,1.27 | SV1.32 27.94,1.27 | SV1.24 38.1,1.27 | SV1.16 48.26,1.27 | 33.02,47.62 33.02,50.8 25.4,58.42 15.24,58.42 15.24,68.58 VIDC_BOTTOM1.9 11.43,72.39 6.35,72.39 1.27,67.31
  Bottom 0.406: 35.56,48.26 33.66,48.26 33.02,47.62 33.02,45.72 32.38,45.09 31.75,45.09
  Bottom 0.61: 24.13,29.84 24.13,35.56 23.5,36.2 23.5,38.1 | 31.75,45.09 24.77,45.09 23.5,43.81 23.5,39.37 | 23.5,39.37 23.5,38.1 | 1.27,48.26 1.27,67.31 | v13.97,26.04 20.32,26.04 20.64,26.36 20.64,26.35 v20.95,26.04 | 23.5,39.37 23.18,39.69 C6.2 15.55,39.69 v14.61,40.64 | C7.2 22.54,38.1 23.5,38.1 | 35.56,48.26 VIDC_BOTTOM1.45
  other vias: 45.72,12.7 68.58,12.7 22.86,11.43 68.58,39.37 55.88,25.4 34.29,25.4 8.89,20.95 1.91,71.12 3.17,66.04 10.79,64.77 24.13,31.75 24.13,34.29 8.89,78.11 69.85,71.12 45.4,30.48 26.04,52.07
  pour Bottom (isolate 0.305): 0,74.93 5.08,80.01 72.39,80.01 72.39,0 0,0
  pour Top (isolate 0.305): 0,80.01 67.31,80.01 72.39,74.93 72.39,0 0,0
N$1
  Top 0.305: RN9.4 4.97,9.53 3.17,9.53 2.22,10.48 IC3.26
N$2
  Top 0.305: RN9.3 3.58,10.39 2.86,11.11 IC3.27
N$3
  Top 0.305: IC3.29 4.13,16.19 3.81,15.88 3.81,11.43 4.04,11.2 RN9.2
N$4
  Top 0.305: IC3.30 4.76,15.56 4.45,15.24 4.45,12.06 4.97,12.06 RN9.1
N$5
  Top 0.305: IC3.32 6.03,15.56 9.53,12.06 10.19,12.06 RN10.4
N$6
  Top 0.305: IC3.33 6.67,16.19 9.53,13.34 10.79,13.34 11.03,13.1 RN10.3
N$7
  Top 0.305: IC3.35 7.94,16.19 10.16,13.97 11.43,13.97 11.83,13.57 RN10.2
N$8
  Top 0.305: IC3.36 8.57,16.83 10.79,14.61 12.06,14.61 12.63,14.04 RN10.1
N$9
  Top 0.305: IC1.47 62.55,21.91 63.5,20.95 65.41,20.95 65.97,20.39 RN1.1
N$10
  Top 0.305: IC1.46 61.91,21.27 62.87,20.32 64.77,20.32 65.17,19.92 RN1.2
N$11
  Top 0.305: IC1.44 60.64,21.27 62.23,19.68 64.14,19.68 64.37,19.45 RN1.3
N$12
  Top 0.305: IC1.43 60.01,20.64 61.59,19.05 62.87,19.05 63.57,18.34 RN1.4
N$13
  Top 0.305: IC1.41 58.74,19.37 60.89,17.21 RN2.1
N$14
  Top 0.305: IC1.40 58.1,18.73 60.09,16.75 RN2.2
N$15
  Top 0.305: IC1.38 56.83,18.73 59.29,16.27 RN2.3
N$16
  Top 0.305: IC1.37 56.2,18.1 58.49,15.8 RN2.4
N$17
  Top 0.305: IC1.36 55.56,17.46 55.88,17.14 55.88,14.71 RN3.1
N$18
  Top 0.305: IC1.35 54.93,14.73 RN3.2
N$19
  Top 0.305: IC1.33 53.66,20.64 54.21,20.09 RN3.3
N$20
  Top 0.305: IC1.32 53.02,19.37 53.41,18.98 RN3.4
N$21
  Top 0.305: IC1.30 51.75,19.37 50.8,18.41 50.8,14.71 RN4.1
N$22
  Top 0.305: RN4.2 49.93,18.82 51.12,20 IC1.29
N$23
  Top 0.305: IC3.37 9.21,17.46 11.43,15.24 12.7,15.24 17.78,10.16 18.3,10.16 RN11.4
N$24
  Top 0.305: IC1.27 49.85,20 49.13,19.29 RN4.3
N$25
  Top 0.305: IC1.26 49.21,20.64 48.26,19.68 48.26,14.71 RN4.4
N$26
  Top 0.305: IC2.47 40.96,20.64 41.84,19.75 RN5.1
N$27
  Top 0.305: IC2.46 40.32,20 41.04,19.29 RN5.2
N$28
  Top 0.305: IC2.44 39.05,20 40.24,18.82 RN5.3
N$29
  Top 0.305: IC2.43 38.42,19.37 39.37,18.41 39.37,14.71 RN5.4
N$30
  Top 0.305: IC2.41 37.15,16.83 37.47,16.51 37.47,14.71 RN6.1
N$31
  Top 0.305: IC2.40 36.51,14.73 RN6.2
N$32
  Top 0.305: IC2.38 35.24,20 35.8,19.45 RN6.3
N$33
  Top 0.305: IC2.37 34.61,18.73 34.92,18.41 34.92,14.71 RN6.4
N$34
  Top 0.305: IC2.36 33.97,15.67 RN7.1
N$35
  Top 0.305: RN7.2 32.15,15.64 33.02,16.51 33.02,20.32 33.34,20.64 IC2.35
N$36
  Top 0.305: IC2.33 32.07,20.64 32.38,20.32 32.38,17.14 31.35,16.11 RN7.3
N$37
  Top 0.305: IC2.32 31.43,20 31.75,19.68 31.75,17.78 30.55,16.58 RN7.4
N$38
  Top 0.305: IC2.30 30.16,20 28.5,18.34 RN8.1
N$39
  Top 0.305: IC2.29 29.53,20.64 27.7,18.82 RN8.2
N$40
  Top 0.305: IC2.27 28.26,20.64 26.91,19.29 RN8.3
N$41
  Top 0.305: IC2.26 27.62,21.27 26.11,19.75 RN8.4
N$42
  Top 0.305: RN1.8 65.97,5.15 SV1.1
N$43
  Top 0.305: RN1.7 65.17,8.02 64.77,7.62 64.77,3.81 SV1.2
N$44
  Top 0.305: RN1.6 64.37,8.49 63.5,7.62 SV1.3
N$45
  Top 0.305: RN1.5 63.57,8.96 62.23,7.62 62.23,3.81 SV1.4
N$46
  Top 0.305: RN5.8 41.84,12.77 43.18,11.43 SV1.19
N$47
  Top 0.305: RN2.8 60.89,5.15 SV1.5
N$48
  Top 0.305: RN2.7 60.09,6.75 59.69,6.35 59.69,3.81 SV1.6
N$49
  Top 0.305: RN2.6 59.29,8.49 58.42,7.62 SV1.7
N$50
  Top 0.305: RN2.5 58.49,8.96 57.15,7.62 57.15,6.35 SV1.9
N$51
  Top 0.305: RN3.7 55.01,9.29 53.34,7.62 SV1.11
N$52
  Top 0.305: RN5.7 41.04,12.3 41.91,11.43 41.91,3.81 SV1.20
N$53
  Top 0.305: RN3.8 55.81,7.55 54.61,6.35 54.61,3.81 SV1.10
N$54
  Top 0.305: RN3.5 53.41,10.23 50.8,7.62 SV1.13
N$55
  Top 0.305: RN3.6 54.21,9.76 52.07,7.62 52.07,3.81 SV1.12
N$56
  Top 0.305: RN4.7 49.93,9.93 48.26,8.26 SV1.15
N$57
  Top 0.305: RN4.8 50.73,9.46 49.53,8.26 49.53,3.81 SV1.14
N$58
  Top 0.305: RN4.6 49.13,10.39 46.35,7.62 46.35,5.71 SV1.17
N$59
  Top 0.305: RN5.5 39.44,3.74 SV1.22
N$60
  Top 0.305: RN5.6 40.24,11.2 40.64,10.79 SV1.21
N$61
  Top 0.305: RN4.5 48.33,10.87 44.45,6.99 44.45,3.81 SV1.18
N$62
  Top 0.305: RN8.5 26.11,12.13 21.59,7.62 21.59,3.81 SV1.36
N$63
  Top 0.305: RN10.8 14.64,10.76 19.05,6.35 19.05,3.81 SV1.38
N$64
  Top 0.305: RN6.6 35.8,9.12 34.29,7.62 34.29,3.81 SV1.26
N$65
  Top 0.305: RN6.8 37.4,12.13 38.1,11.43 SV1.23
N$66
  Top 0.305: RN7.8 32.95,10.09 31.75,8.89 31.75,3.81 SV1.28
N$67
  Top 0.305: RN6.7 36.59,6.12 SV1.25
N$68
  Top 0.305: RN11.5 20.32,9.63 SV1.37
N$69
  Top 0.305: RN10.5 10.23,9.46 12.7,6.99 13.34,6.99 13.97,6.35 13.97,3.81 SV1.42
N$70
  Top 0.305: RN6.5 34.99,9.6 33.02,7.62 SV1.27
N$71
  Top 0.305: RN10.7 11.83,10.39 12.7,9.53 14.61,9.53 17.78,6.35 SV1.39
N$72
  Top 0.305: RN9.7 7.86,11.2 8.26,10.79 8.26,8.89 11.43,5.71 11.43,3.81 SV1.44
N$73
  Top 0.305: SV1.43 12.7,5.71 8.89,9.53 8.89,11.43 8.32,11.99 RN9.8
N$74
  Top 0.61: 64.77,63.5 63.5,64.77 63.5,62.23 arc180 68.58,62.23 68.58,64.77 67.31,63.5
N$86
  Top 0.305: RN7.7 32.15,10.56 30.48,8.89 SV1.29
N$87
  Top 0.305: RN9.6 7.38,10.39 7.62,10.16 7.62,8.26 10.16,5.71 SV1.45
N$88
  Top 0.305: RN7.6 31.35,11.03 29.21,8.89 29.21,3.81 SV1.30
N$89
  Top 0.305: RN8.7 27.7,11.2 24.13,7.62 24.13,3.81 SV1.34
N$91
  Top 0.305: RN10.6 11.03,9.93 12.7,8.26 13.97,8.26 15.24,6.99 SV1.41
N$93
  Top 0.305: RN7.5 30.55,11.5 27.94,8.89 SV1.31
N$94
  Top 0.305: RN8.8 28.5,10.72 25.4,7.62 SV1.33
N$95
  Top 0.305: RN8.6 26.91,11.66 22.86,7.62 SV1.35
N$96
  Top 0.305: SV1.46 8.89,3.81 6.99,3.81 6.35,4.45 6.35,6.35 6.39,6.39 RN9.5
NHS  (via drill 0.6)
  Top 0.305: v7.62,40.64 7.94,40.32 IC3.14 | VIDC_BOTTOM1.62 v10.16,43.18
  Bottom 0.305: v7.62,40.64 v10.16,43.18
NSNDRQ
  Top 0.305: IC3.16 6.67,44.77 VIDC_BOTTOM1.63
NVCS
  Top 0.305: IC3.13 8.57,44.13 VIDC_BOTTOM1.61
NVIDRQ
  Top 0.305: IC3.17 6.03,46.67 12.7,53.34 15.24,53.34 VIDC_BOTTOM1.64
NVIDW
  Top 0.305: IC3.12 9.21,39.69 VIDC_BOTTOM1.60
SNDAK
  Top 0.305: IC3.22 2.86,62.55 8.89,68.58 17.14,68.58 17.78,69.22 17.78,71.12 VIDC_BOTTOM1.10
VIDAK
  Top 0.305: IC3.23 2.22,63.18 10.16,71.12 15.24,71.12 VIDC_BOTTOM1.11

### Text on the board
Top: 221021 A3K/v2 | VIDC interposer
Bottom: (c) 2021 Matt Evans